# EAGLE design LAMPS (EAGLE 6.3)
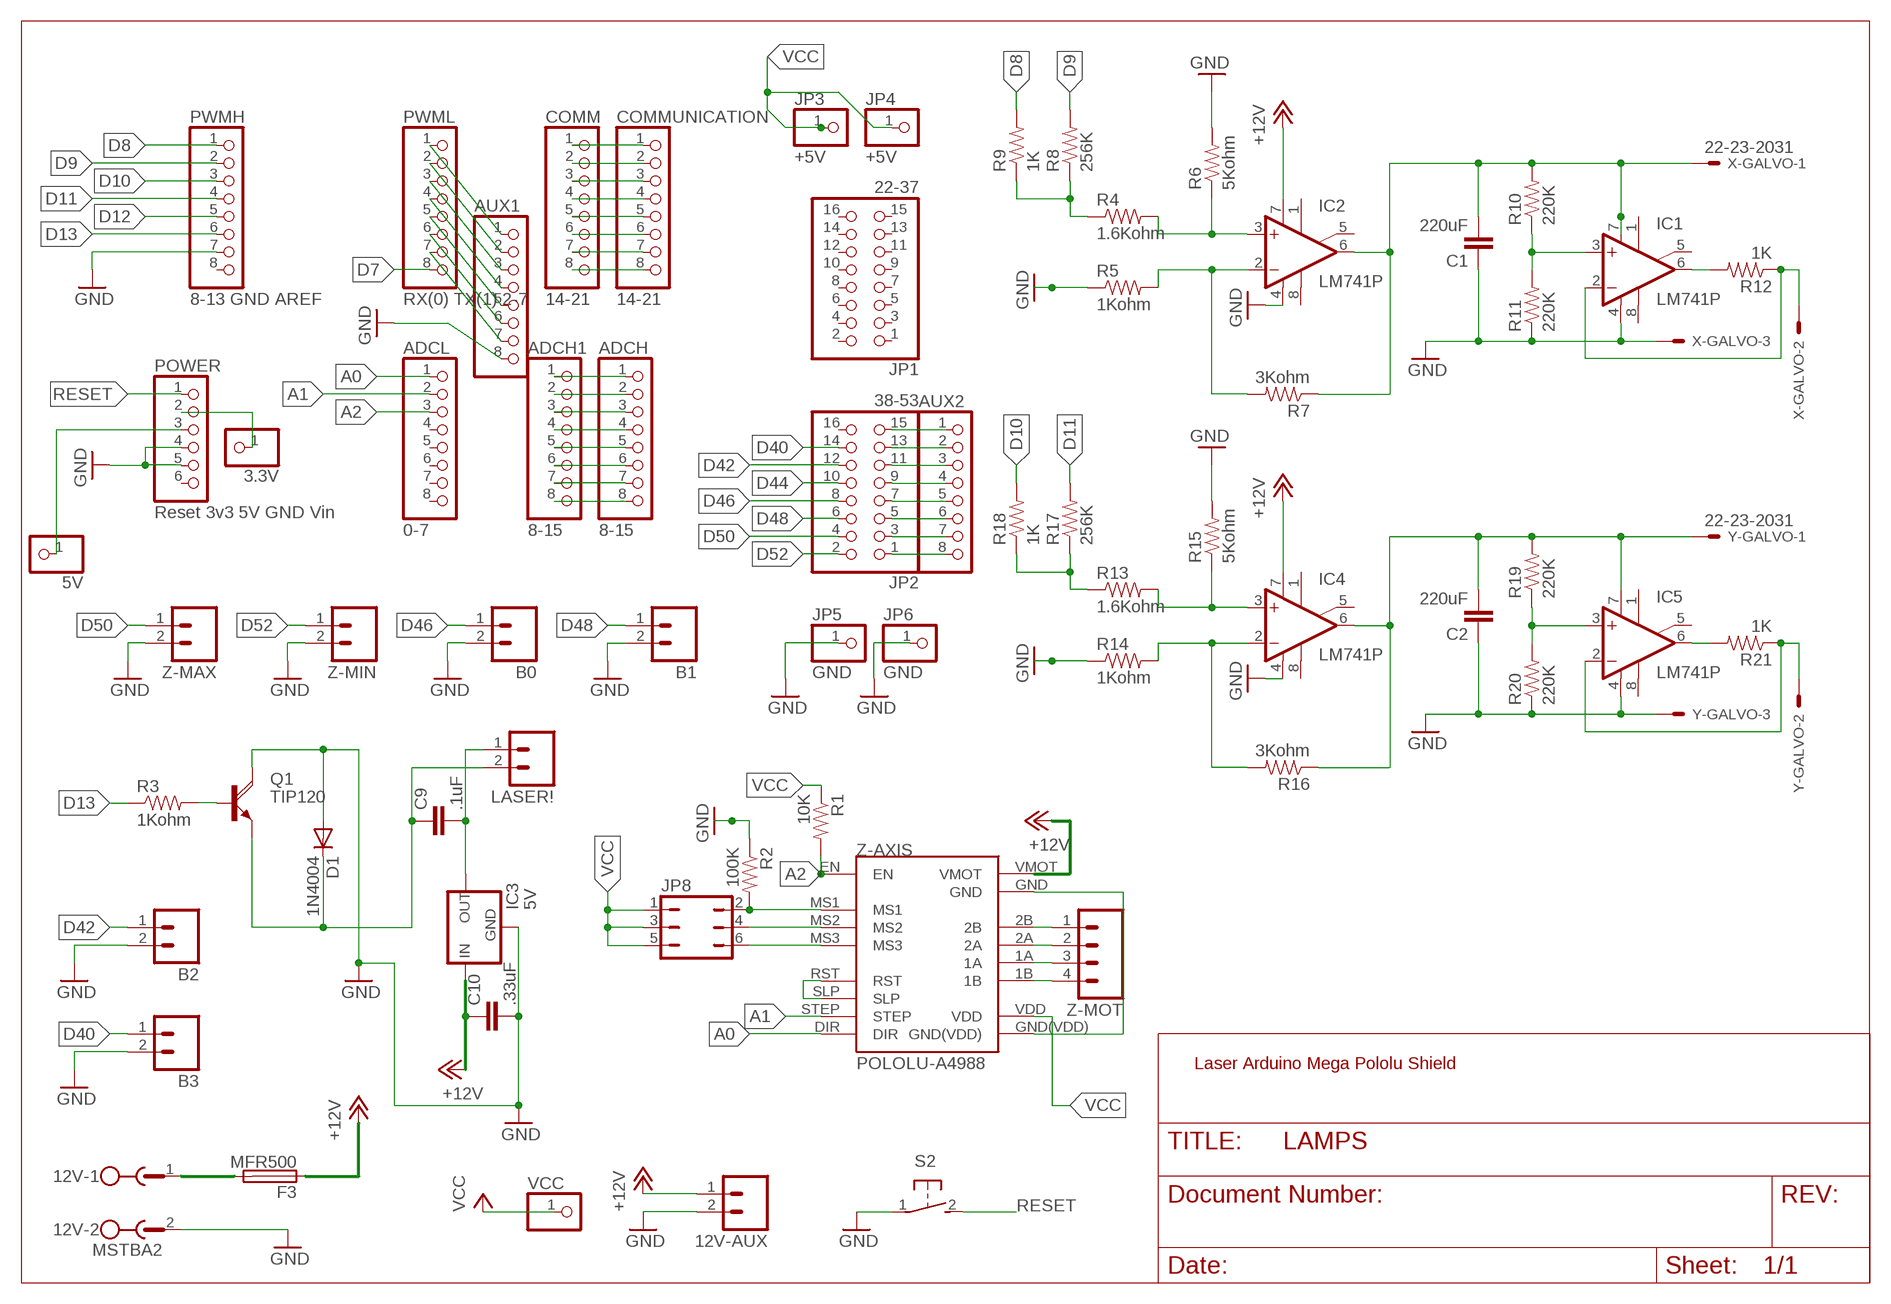
[diagram p0: schematic, sheet 1]

## Parts
3.3V  PINHD-1X1  [1X01]
5V  PINHD-1X1  [1X01]
12V  MSTBA2  [MSTBA2]
12V-AUX  M02PTH  [1X02]
ADCH  8-15  PINHD-1X8  [1X08]
ADCH1  8-15  PINHD-1X8  [1X08]
ADCL  0-7  PINHD-1X8  [1X08]
AUX1  14-21  PINHD-1X8  [1X08]
AUX2  14-21  PINHD-1X8  [1X08]
B0  M02PTH  [1X02]
B1  M02PTH  [1X02]
B2  M02PTH  [1X02]
B3  M02PTH  [1X02]
C1  220uF  CAPPTH  [CAP-PTH-SMALL]
C2  220uF  CAPPTH  [CAP-PTH-SMALL]
C9  .1uF  CAPPTH  [CAP-PTH-SMALL]
C10  .33uF  CAPPTH  [CAP-PTH-SMALL]
COMM  14-21  PINHD-1X8  [1X08]
COMMUNICATION  14-21  PINHD-1X8  [1X08]
D1  1N4004  [DO41-10]
F3  MFR500  PTCFUSE  [MFR500]
IC1  LM741P  [DIL08]
IC2  LM741P  [DIL08]
IC3  5V  V_REG_78XXSIDE  [78XXL]
IC4  LM741P  [DIL08]
IC5  LM741P  [DIL08]
JP1  22-37  PINHD-2X8  [2X08]
JP2  38-53  PINHD-2X8  [2X08]
JP3  +5V  PINHD-1X1  [1X01]
JP4  +5V  PINHD-1X1  [1X01]
JP5  GND  PINHD-1X1  [1X01]
JP6  GND  PINHD-1X1  [1X01]
JP8  JP3Q  [JP3Q]
LASER!  M02POLAR  [MOLEX-1X2]
POWER  Reset 3v3 5V GND Vin  PINHD-1X6  [1X06]
PWMH  8-13 GND AREF  PINHD-1X8  [1X08]
PWML  RX(0) TX(1) 2-7  PINHD-1X8  [1X08]
Q1  TIP120  [TO220AH]
R1  10K  RESISTORAXIAL-0.3  [AXIAL-0.3]
R2  100K  RESISTORAXIAL-0.3  [AXIAL-0.3]
R3  1Kohm  RESISTORAXIAL-0.3  [AXIAL-0.3]
R4  1.6Kohm  RESISTORAXIAL-0.3  [AXIAL-0.3]
R5  1Kohm  RESISTORAXIAL-0.3  [AXIAL-0.3]
R6  5Kohm  RESISTORAXIAL-0.3  [AXIAL-0.3]
R7  3Kohm  RESISTORAXIAL-0.3  [AXIAL-0.3]
R8  256K  RESISTORAXIAL-0.3  [AXIAL-0.3]
R9  1K  RESISTORAXIAL-0.3  [AXIAL-0.3]
R10  220K  RESISTORAXIAL-0.3  [AXIAL-0.3]
R11  220K  RESISTORAXIAL-0.3  [AXIAL-0.3]
R12  1K  RESISTORAXIAL-0.3  [AXIAL-0.3]
R13  1.6Kohm  RESISTORAXIAL-0.3  [AXIAL-0.3]
R14  1Kohm  RESISTORAXIAL-0.3  [AXIAL-0.3]
R15  5Kohm  RESISTORAXIAL-0.3  [AXIAL-0.3]
R16  3Kohm  RESISTORAXIAL-0.3  [AXIAL-0.3]
R17  256K  RESISTORAXIAL-0.3  [AXIAL-0.3]
R18  1K  RESISTORAXIAL-0.3  [AXIAL-0.3]
R19  220K  RESISTORAXIAL-0.3  [AXIAL-0.3]
R20  220K  RESISTORAXIAL-0.3  [AXIAL-0.3]
R21  1K  RESISTORAXIAL-0.3  [AXIAL-0.3]
S2  31-XX  [B3F-31XX]
VCC  PINHD-1X1  [1X01]
X-GALVO  22-23-2031  [22-23-2031]
Y-GALVO  22-23-2031  [22-23-2031]
Z-AXIS  POLOLU-A4988  [DIL_A4988]
Z-MAX  M02PTH  [1X02]
Z-MIN  M02PTH  [1X02]
Z-MOT  M04POLAR  [MOLEX-1X4]

## Nets
+12V: 12V-AUX.1 C10.1 F3.1 IC2.7(V+) IC3.IN IC4.7(V+) Z-AXIS.VMOT
A0: ADCL.1 Z-AXIS.DIR
A1: ADCL.2 Z-AXIS.STEP
A2: ADCL.3 R1.P$2 Z-AXIS.EN
D7: PWML.8
D8: PWMH.1 R9.P$2
D9: PWMH.2 R8.P$2
D10: PWMH.3 R18.P$2
D11: PWMH.4 R17.P$2
D12: PWMH.5
D13: PWMH.6 R3.P$1
D40: B3.1 JP2.14
D42: B2.1 JP2.12
D44: JP2.10 Q1.B R3.P$2
D46: B0.1 JP2.8
D48: B1.1 JP2.6
D50: JP2.4 Z-MAX.1
D52: JP2.2 Z-MIN.1
GND: 12V-AUX.2 12V.2 AUX1.8 B0.2 B1.2 B2.2 B3.2 C1.1 C2.1 C10.2 D1.A IC1.4(V-) IC2.4(V-) IC3.GND IC4.4(V-) IC5.4(V-) JP5.1 JP6.1 POWER.4 POWER.5 PWMH.7 Q1.C R2.P$1 R5.P$1 R6.P$2 R11.P$1 R14.P$1 R15.P$2 R20.P$1 S2.1(P) X-GALVO.3 Y-GALVO.3 Z-MAX.2 Z-MIN.2
N$1: IC2.3(+IN) R4.P$2 R6.P$1
N$2: IC2.2(-IN) R5.P$2 R7.P$2
N$3: IC1.3(+IN) R10.P$1 R11.P$2
N$4: R4.P$1 R8.P$1 R9.P$1
N$5: IC4.3(+IN) R13.P$2 R15.P$1
N$6: C1.2 IC1.7(V+) IC2.6(OUT) R7.P$1 R10.P$2 X-GALVO.1
N$7: IC1.6(OUT) R12.P$2
N$8: 3.3V.1 POWER.2
N$9: COMM.1 COMMUNICATION.1
N$10: 5V.1 POWER.3
N$11: Z-AXIS.RST Z-AXIS.SLP
N$12: C9.2 IC3.OUT LASER!.1
N$13: C9.1 D1.C LASER!.2 Q1.E
N$14: Z-AXIS.GND Z-AXIS.GND(VDD)
N$15: JP8.2 R2.P$2 Z-AXIS.MS1
N$16: JP8.4 Z-AXIS.MS2
N$17: JP8.6 Z-AXIS.MS3
N$18: IC1.2(-IN) R12.P$1 X-GALVO.2
N$19: IC4.2(-IN) R14.P$2 R16.P$2
N$20: Z-AXIS.2B Z-MOT.1
N$21: Z-AXIS.2A Z-MOT.2
N$22: Z-AXIS.1A Z-MOT.3
N$23: Z-AXIS.1B Z-MOT.4
N$24: R13.P$1 R17.P$1 R18.P$1
N$25: C2.2 IC4.6(OUT) IC5.7(V+) R16.P$1 R19.P$2 Y-GALVO.1
N$26: IC5.3(+IN) R19.P$1 R20.P$2
N$27: IC5.6(OUT) R21.P$2
N$28: IC5.2(-IN) R21.P$1 Y-GALVO.2
N$29: COMM.2 COMMUNICATION.2
N$35: COMM.3 COMMUNICATION.3
N$36 [power]: 12V.1 F3.2
N$37: COMM.4 COMMUNICATION.4
N$38: COMM.5 COMMUNICATION.5
N$39: COMM.6 COMMUNICATION.6
N$40: COMM.7 COMMUNICATION.7
N$41: COMM.8 COMMUNICATION.8
N$42: ADCH1.1 ADCH.1
N$43: ADCH1.2 ADCH.2
N$44: ADCH1.3 ADCH.3
N$45: ADCH1.4 ADCH.4
N$46: ADCH1.5 ADCH.5
N$47: ADCH1.6 ADCH.6
N$48: ADCH1.7 ADCH.7
N$49: ADCH1.8 ADCH.8
N$66: AUX2.1 JP2.15
N$67: AUX2.2 JP2.13
N$68: AUX2.3 JP2.11
N$69: AUX2.4 JP2.9
N$70: AUX2.5 JP2.7
N$71: AUX2.6 JP2.5
N$72: AUX2.7 JP2.3
N$73: AUX2.8 JP2.1
N$74: AUX1.1 PWML.1
N$75: AUX1.2 PWML.2
N$76: AUX1.3 PWML.3
N$77: AUX1.4 PWML.4
N$78: AUX1.5 PWML.5
N$79: AUX1.6 PWML.6
N$80: AUX1.7 PWML.7
RESET: POWER.1 S2.2(S)
VCC: JP3.1 JP4.1 JP8.1 JP8.3 JP8.5 R1.P$1 VCC.1 Z-AXIS.VDD
Unconnected: ADCL.4 ADCL.5 ADCL.6 ADCL.7 ADCL.8 IC1.1(ON1) IC1.5(ON2) IC1.8(OPT) IC2.1(ON1) IC2.5(ON2) IC2.8(OPT) IC4.1(ON1) IC4.5(ON2) IC4.8(OPT) IC5.1(ON1) IC5.5(ON2) IC5.8(OPT) JP1.1 JP1.2 JP1.3 JP1.4 JP1.5 JP1.6 JP1.7 JP1.8 JP1.9 JP1.10 JP1.11 JP1.12 JP1.13 JP1.14 JP1.15 JP1.16 JP2.16 POWER.6 PWMH.8

## Notes on the sheet
- Laser Arduino Mega Pololu Shield

## Library data of the parts
3.3V 5V VCC = adafruit:PINHD-1X1: Pin header 1x1 for 0.1" spacing With round pins; OC_NEWARK: unknown
12V = con-phoenix-508:MSTBA2: PHOENIX; MF: FARNELL; MPN: 1757242; OC_FARNELL: 3705171; OC_NEWARK: 71C4161
12V-AUX B0 B1-B3 LASER! Z-MAX Z-MIN = SparkFun:M02: Header 2 Standard 2-pin 0.1" header. Use with straight break away headers (SKU : PRT-00116), right angle break away headers (PRT-00553), swiss pins (PRT-00743), machine pins (PRT-00117), and female headers (PRT-00115). Molex polarized connector foot print use with SKU : PRT-08233 with associated crimp pins and housings.; OC_NEWARK: unknown
ADCH ADCH1 ADCL AUX1 AUX2 COMM COMMUNICATION PWMH PWML = pinhead:PINHD-1X8: PIN HEADER; OC_NEWARK: unknown
C1 C2 = SparkFun:CAP: Capacitor Standard 0603 ceramic capacitor, and 0.1" leaded capacitor.; MPN: 100PK220MEFC12.5X20; OC_NEWARK: 39T8339
C9 C10 = SparkFun:CAP: Capacitor Standard 0603 ceramic capacitor, and 0.1" leaded capacitor.; OC_NEWARK: unknown
D1 = diode:1N4004: DIODE general purpose rectifier, 1 A; OC_NEWARK: unknown
F3 = RepRapjr:PTCFUSE: LITTLEFUSE Picofuse/slow Littlefuse; OC_NEWARK: unknown
IC1 IC2 IC4 IC5 = linear:*741: OP AMP; OC_NEWARK: unknown
IC3 = SparkFun:V_REG_78XX: Voltage Regulator Standard 7805 5V regulator. IGO (Input Ground Output). Spark Fun Electronics SKU : COM-00107; OC_NEWARK: unknown
JP1 JP2 = pinhead:PINHD-2X8: PIN HEADER; OC_NEWARK: unknown
JP3-JP6 = pinhead:PINHD-1X1: PIN HEADER; OC_NEWARK: unknown
JP8 = jumper:JP3Q: JUMPER; OC_NEWARK: unknown
POWER = pinhead:PINHD-1X6: PIN HEADER; OC_NEWARK: unknown
Q1 = transistor-power:TIP120: NPN DARLINGTON TRANSISTOR; OC_NEWARK: unknown
R1-R21 = SparkFun:RESISTOR: Resistor Basic schematic elements and footprints for 0603, 1206, and PTH resistors.; OC_NEWARK: unknown
S2 = switch-omron:31-XX: OMRON SWITCH; MPN: B3F-3100; OC_FARNELL: 959704; OC_NEWARK: unknown
X-GALVO Y-GALVO = con-molex:22-23-2031: .100" (2.54mm) Center Header - 3 Pin; MF: MOLEX; MPN: 22-23-2031; OC_FARNELL: 1462950; OC_NEWARK: 30C0862
Z-AXIS = Pololu-A4988:POLOLU-A4988; OC_NEWARK: unknown
Z-MOT = SparkFun:M04: Header 4 Standard 4-pin 0.1" header. Use with straight break away headers (SKU : PRT-00116), right angle break away headers (PRT-00553), swiss pins (PRT-00743), machine pins (PRT-00117), and female headers (PRT-00115). Molex polarized connector foot print use with SKU : PRT-08231 with associated crimp pins and housings. 1MM SMD Version SKU: PRT-10208; OC_NEWARK: unknown

## Net classes
0 default: width 0.203 mm, drill 0.406 mm, clearance 0.203 mm
1 power: width 0.61 mm, drill 0.711 mm, clearance 0.203 mm
2 gnd: width 0.305 mm, drill 0.711 mm, clearance 0.203 mm
3 usbvcc: width 0.508 mm, drill 0.711 mm, clearance 0.203 mm

## Board
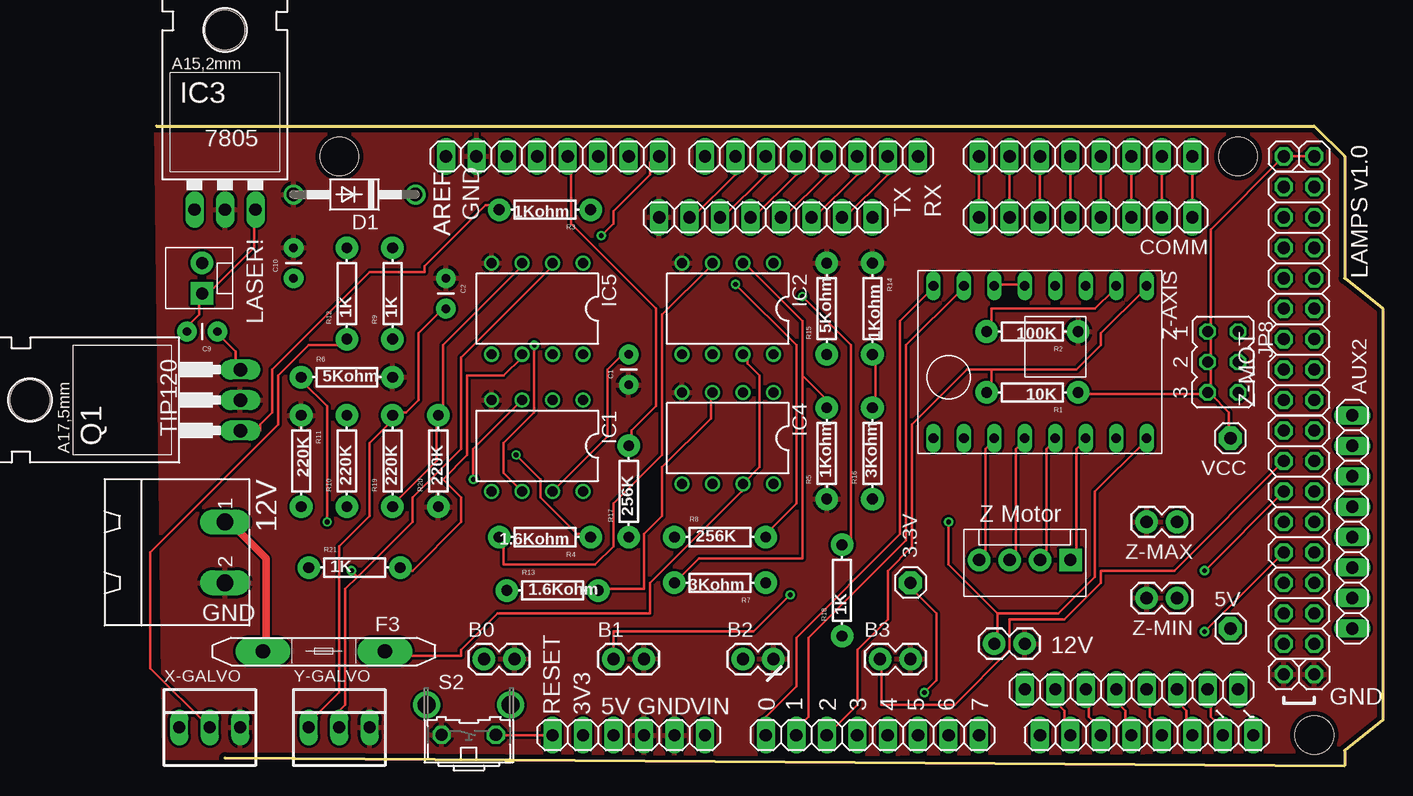
[diagram p1: board, top side]
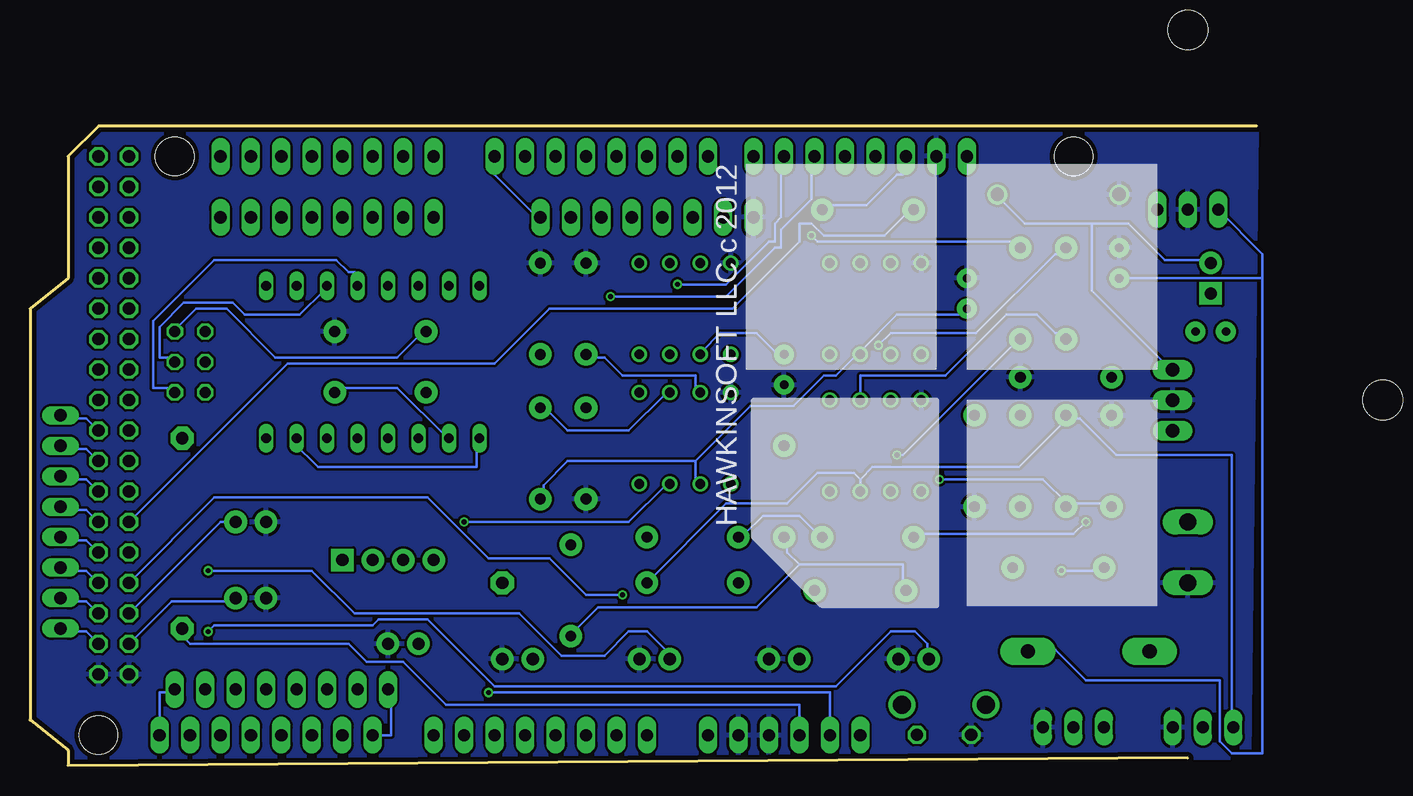
[diagram p2: board, bottom side, seen from below]

Size 102.23 x 53.34 mm. Coordinates in mm from the lower left corner, seen from the top.
Outline: 0,53.34 96.52,53.34 99.06,50.8 99.06,40.64 102.23,38.1 102.23,3.81 99.06,1.27 99.06,0 5.71,0.64
Copper layers (1*16): Top 0.0356mm / dielectric 1.5011mm / Bottom 0.0356mm
Design rules "LaenPCBOrder": minimum track width 6mil, minimum drill 13mil, track to track 6mil, track to pad 6mil, pad to pad 6mil, via to via 6mil, smd to smd 6mil, copper to edge 15mil, drill to drill 6mil, minimum pad ring 7mil, minimum via ring 7mil, stop-mask expansion 4mil, vias tented up to drill 0mil, thermal gap 10mil
Holes 3.2 mm at 96.52,2.54 15.24,50.8 90.17,50.8

### Footprints (pad centres in the part's own frame; a part is rotated, then mirrored left to right if it is on the bottom)
1X01 = drill 1.016 pad 1.93 octagon: 1 0,0
MSTBA2 = drill 1.397 long: 1 -2.54,5.08; 2 2.54,5.08
1X02 = drill 1.016 pad 1.88: 1 0,0; 2 2.54,0
1X08 = drill 1.016 long: 1 -8.89,0; 2 -6.35,0; 3 -3.81,0; 4 -1.27,0; 5 1.27,0; 6 3.81,0; 7 6.35,0; 8 8.89,0
CAP-PTH-SMALL = drill 0.7 pad 1.651: 1 0,0; 2 2.54,0
DO41-10 = drill 1.118: A 5.08,0; C -5.08,0
MFR500 = drill 1.2 pad 2.3 long: 1 -5.08,0; 2 5.08,0
DIL08 = drill 0.813 pad 1.27: 1 -3.81,-3.81; 2 -1.27,-3.81; 3 1.27,-3.81; 4 3.81,-3.81; 5 3.81,3.81; 6 1.27,3.81; 7 -1.27,3.81; 8 -3.81,3.81
78XXL = drill 1.016 long: GND 0,-3.81; IN -2.54,-3.81; OUT 2.54,-3.81 | hole 3.302: 0,11.176
2X08 = drill 1.016 octagon: 1 -8.89,-1.27; 2 -8.89,1.27; 3 -6.35,-1.27; 4 -6.35,1.27; 5 -3.81,-1.27; 6 -3.81,1.27; 7 -1.27,-1.27; 8 -1.27,1.27; 9 1.27,-1.27; 10 1.27,1.27; 11 3.81,-1.27; 12 3.81,1.27; 13 6.35,-1.27; 14 6.35,1.27; 15 8.89,-1.27; 16 8.89,1.27
1X01' = drill 1.016 octagon: 1 0,0
JP3Q = drill 0.914 octagon: 1 -2.54,-1.27; 2 -2.54,1.27; 3 0,-1.27; 4 0,1.27; 5 2.54,-1.27; 6 2.54,1.27
MOLEX-1X2 = drill 1.016 pad 1.88 square: 1 0,0 | drill 1.016 pad 1.88: 2 2.54,0
1X06 = drill 1.016 long: 1 -6.35,0; 2 -3.81,0; 3 -1.27,0; 4 1.27,0; 5 3.81,0; 6 6.35,0
TO220AH = drill 1.118 long: B -2.54,-6.35; C 0,-6.35; E 2.54,-6.35 | hole 3.302: 0,11.176
AXIAL-0.3 = drill 0.9 pad 1.88: P$1 -3.81,0; P$2 3.81,0
B3F-31XX = drill 1.016 octagon: 1 -2.261,-1.245; 2 2.261,-1.245 | drill 1.499 pad 2.159: 3 -3.505,1.245; 4 3.505,1.245
22-23-2031 = drill 1 long: 1 -2.54,0; 2 0,0; 3 2.54,0
DIL_A4988 = drill 0.8 long: 1A 12.7,7.62; 1B 12.7,5.08; 2A 12.7,10.16; 2B 12.7,12.7; DIR 0,0; EN 0,17.78; GND 12.7,15.24; GND(VDD) 12.7,0; MS1 0,15.24; MS2 0,12.7; MS3 0,10.16; RST 0,7.62; SLP 0,5.08; STEP 0,2.54; VDD 12.7,2.54; VMOT 12.7,17.78
MOLEX-1X4 = drill 1.016 pad 1.88 square: 1 0,0 | drill 1.016 pad 1.88: 2 2.54,0; 3 5.08,0; 4 7.62,0

### Placement (x,y rotation side)
3.3V  62.87,15.24 270 top
5V  89.53,11.43 0 top
12V  0.64,17.78 270 top
12V-AUX  69.85,10.16 0 top
ADCH  82.55,2.54 0 top
ADCH1  81.28,6.35 0 top
ADCL  59.69,2.54 0 top
AUX1  50.8,45.72 180 top
AUX2  99.69,20.32 270 top
B0  27.3,8.89 0 top
B1  38.1,8.89 0 top
B2  48.9,8.89 0 top
B3  60.33,8.89 0 top
C1  39.37,31.75 90 top
C2  24.13,40.64 270 top
C9  5.08,36.2 180 top
C10  11.43,40.64 90 top
COMM  77.47,45.72 180 top
COMMUNICATION  77.47,50.8 180 top
D1  16.51,47.62 180 top
F3  13.97,9.53 180 top
IC1  31.75,26.67 180 top
IC2  47.62,38.1 180 top
IC3  5.71,50.16 0 top
IC4  47.62,27.3 180 top
IC5  31.75,38.1 180 top
JP1  95.25,39.37 90 top
JP2  95.25,19.05 90 top
JP3  +5V  [1X01']  93.98,50.8 0 top
JP4  +5V  [1X01']  96.52,50.8 0 top
JP5  GND  [1X01']  93.98,7.62 0 top
JP6  GND  [1X01']  96.52,7.62 0 top
JP8  88.9,33.66 270 top
LASER!  3.81,39.37 90 top
POWER  39.37,2.54 0 top
PWMH  33.02,50.8 180 top
PWML  54.61,50.8 180 top
Q1  0.64,30.48 90 top
R1  73.03,31.11 180 top
R2  73.03,36.2 180 top
R3  32.38,46.35 180 top
R4  32.38,19.05 180 top
R5  55.88,26.04 90 top
R6  15.88,32.38 0 top
R7  46.99,15.24 180 top
R8  46.99,19.05 0 top
R9  19.68,39.37 90 top
R10  15.88,25.4 90 top
R11  12.06,25.4 270 top
R12  15.88,39.37 90 top
R13  33.02,14.61 0 top
R14  59.69,38.1 270 top
R15  55.88,38.1 90 top
R16  59.69,26.04 90 top
R17  39.37,22.86 90 top
R18  57.15,14.61 90 top
R19  19.68,25.4 90 top
R20  23.5,25.4 90 top
R21  16.51,16.51 0 top
S2  26.04,3.81 0 top
VCC  89.53,27.3 180 top
X-GALVO  4.45,3.17 0 top
Y-GALVO  15.24,3.17 0 top
Z-AXIS  64.77,40.01 270 top
Z-MAX  85.09,20.32 180 top
Z-MIN  85.09,13.97 180 top
Z-MOT  76.2,17.14 180 top

### Tracks (layer width: path | path; a pad name or v marks a point on that pad's centre or on a via)
+12V  (via drill 0.41)
  Top 0.203: 70.1,12.7 75.18,12.7 78.23,15.75 78.23,22.86 82.3,26.92 Z-AXIS.VMOT | 70.1,12.7 70.1,10.16 12V-AUX.1 | IC2.7 49.28,34.04 49.28,33.53 50.29,32.51 50.29,24.89 IC4.7 48.77,23.37 48.77,22.86 41.15,15.24 41.15,12.7 28.45,12.7 25.4,9.65 25.4,9.14 19.3,9.14 F3.1 | 70.1,12.7 66.04,16.76 v66.04,20.32
  Bottom 0.203: IC3.IN -0.51,42.67 -0.51,40.64 | C10.1 -0.51,40.64 | -0.51,40.64 -0.51,1.02 2.03,1.02 3.05,2.03 3.05,7.11 14.22,7.11 16.76,9.65 18.8,9.65 F3.1 | v66.04,20.32 52.32,20.32 49.28,23.37 IC4.7
A0
  Top 0.203: ADCL.1 50.8,4.06 53.34,6.6 53.34,10.67 61.98,19.3 61.98,37.08 64.52,39.62 Z-AXIS.DIR
A1
  Top 0.203: ADCL.2 53.34,3.05 54.36,4.06 54.36,10.67 62.48,18.8 62.48,35.05 67.06,39.62 Z-AXIS.STEP
A2
  Top 0.203: 69.6,33.02 76.71,33.02 78.74,35.05 78.74,36.07 82.3,39.62 Z-AXIS.EN | 69.6,33.02 69.6,31.5 R1.P$2 | ADCL.3 58.42,5.08 58.42,9.65 60.96,12.19 60.96,16.26 62.99,18.29 62.99,28.45 67.56,33.02 69.6,33.02
D8  (via drill 0.41)
  Top 0.203: v37.08,44.2 38.1,45.21 38.1,46.23 41.15,49.28 41.15,50.29 41.66,50.8 PWMH.1
  Bottom 0.203: v37.08,44.2 36.58,43.69 20.32,43.69 19.81,43.18 R9.P$2
D9  (via drill 0.41)
  Top 0.203: v48.26,40.13 53.34,35.05 53.34,21.84 50.8,19.3 R8.P$2
  Bottom 0.203: v48.26,40.13 44.2,40.13 40.64,43.69 40.13,43.69 40.13,45.21 39.62,45.72 39.62,50.8 PWMH.2
D10  (via drill 0.41)
  Top 0.203: v53.85,39.12 57.91,35.05 57.91,18.8 57.4,18.29 R18.P$2
  Bottom 0.203: v53.85,39.12 44.2,39.12 40.13,43.18 39.62,43.18 39.62,44.7 37.08,47.24 37.08,50.8 PWMH.3
D11
  Top 0.203: PWMH.4 34.54,50.8 34.54,45.21 41.66,38.1 41.66,29.97 39.62,27.94 39.62,26.92 R17.P$2
D13
  Bottom 0.203: PWMH.6 29.46,50.8 29.46,49.28 29.97,49.28 32.51,46.74 36.07,46.74 R3.P$1
D40
  Top 0.203: JP2.14 84.84,16.26 78.74,16.26 78.74,15.24 75.69,12.19 71.12,12.19 71.12,9.65 66.55,5.08 60.45,5.08 60.45,8.64 B3.1
D42  (via drill 0.41)
  Top 0.203: v87.38,16.26 JP2.12
  Bottom 0.203: v87.38,16.26 78.74,16.26 75.18,12.7 61.47,12.7 57.91,9.14 54.36,9.14 52.32,11.18 50.8,11.18 48.77,9.14 B2.1
D44
  Top 0.203: Q1.B 8.64,27.94 8.64,28.45 9.65,29.46 9.65,33.02 17.78,41.15 22.35,41.15 22.35,41.66 27.43,46.74 28.45,46.74 R3.P$2
  Bottom 0.203: JP2.10 80.77,33.53 63.5,33.53 58.93,38.1 43.69,38.1 38.1,43.69 38.1,45.21 37.08,45.21 36.07,44.2 30.99,44.2 28.96,46.23 R3.P$2
D46  (via drill 0.41)
  Top 0.203: v87.38,11.18 JP2.8
  Bottom 0.203: v87.38,11.18 86.87,11.68 73.66,11.68 73.15,12.19 69.09,12.19 63.5,6.6 35.05,6.6 30.48,11.18 28.45,11.18 27.43,10.16 27.43,9.14 B0.1
D48  (via drill 0.41)
  Top 0.203: v52.83,14.22 49.78,11.18 38.1,11.18 B1.1
  Bottom 0.203: JP2.6 86.87,22.35 69.09,22.35 64.01,17.27 58.93,17.27 55.88,14.22 v52.83,14.22
D50
  Bottom 0.203: JP2.4 86.36,20.32 Z-MAX.1
D52
  Bottom 0.203: JP2.2 90.42,13.72 85.34,13.72 Z-MIN.1
GND
  pour Bottom: 0,53.34 0.64,0.64 102.87,0 102.87,53.34
  pour Top: 0,53.34 0.64,0.64 102.87,1.27 102.87,53.34
N$1  (via drill 0.41)
  Top 0.203: IC2.3 46.23,41.66 42.16,37.59 42.16,25.91 38.1,21.84 38.1,18.29 36.58,16.76 28.96,16.76 28.96,18.8 R4.P$2 | v14.22,20.32 14.22,29.97 12.19,32 R6.P$1
  Bottom 0.203: v14.22,20.32 15.24,19.3 28.45,19.3 R4.P$2
N$2
  Top 0.203: 53.85,32.51 53.85,37.08 49.28,41.66 IC2.2 | 53.85,32.51 55.88,30.48 R5.P$2 | R7.P$2 45.21,17.27 53.85,17.27 53.85,32.51
N$3  (via drill 0.41)
  Top 0.203: IC1.3 26.42,26.42 v26.42,23.88
  Bottom 0.203: v26.42,23.88 17.78,23.88 15.75,21.84 | 15.75,21.84 12.19,21.84 R11.P$2 | 15.75,21.84 R10.P$1
N$4  (via drill 0.41)
  Top 0.203: v29.97,25.91 32,23.88 32,22.35 35.05,19.3 36.07,19.3 R4.P$1
  Bottom 0.203: R4.P$1 36.58,19.3 38.1,20.83 41.15,20.83 42.67,19.3 43.18,19.3 R8.P$1 | v29.97,25.91 29.46,25.91 19.81,35.56 R9.P$1
N$5
  Top 0.203: R13.P$2 37.08,14.73 40.64,14.73 40.64,19.3 42.16,20.83 42.16,24.89 46.23,28.96 46.23,30.99 IC4.3
  Bottom 0.203: IC4.3 46.74,31.5 46.74,32.51 52.83,32.51 54.36,34.04 55.88,34.04 R15.P$1
N$6
  Top 0.203: IC1.7 37.59,27.43 37.59,33.02 39.12,34.54 C1.2
  Bottom 0.203: IC2.6 46.23,34.54 44.7,36.07 41.66,36.07 40.13,34.54 39.62,34.54 C1.2 | R7.P$1 44.2,21.84 39.12,21.84 36.58,24.38 33.53,24.38 33.02,23.88 | IC1.7 33.02,23.88 | 15.75,28.96 14.73,28.96 11.68,25.91 2.03,25.91 2.03,3.56 X-GALVO.1 | 33.02,23.88 32,24.89 19.81,24.89 15.75,28.96 | 15.75,28.96 R10.P$2
N$7  (via drill 0.41)
  Top 0.203: IC1.6 28.96,24.38 28.96,26.92 31.5,29.46 v31.5,35.05
  Bottom 0.203: v31.5,35.05 30.48,36.07 23.37,36.07 16.76,42.67 16.26,42.67 15.75,43.18 R12.P$2
N$8  (via drill 0.41)
  Top 0.203: v64.01,6.1 65.02,7.11 65.02,12.7 62.99,14.73 62.99,15.24 3.3V.1
  Bottom 0.203: POWER.2 35.56,6.1 v64.01,6.1
N$9
  Top 0.203: COMMUNICATION.1 COMM.1
N$10
  Bottom 0.203: POWER.3 38.1,5.08 67.56,5.08 71.12,8.64 74.17,8.64 75.69,10.16 88.9,10.16 89.92,11.18 5V.1
N$11
  Top 0.203: Z-AXIS.SLP 70.1,40.13 72.14,40.13 Z-AXIS.RST
N$12
  Top 0.203: IC3.OUT 8.13,46.23 8.13,43.18 4.06,39.12 LASER!.1 3.56,39.12 3.56,37.59 2.54,36.58 C9.2
N$13
  Top 0.203: C9.1 5.08,36.07 6.6,34.54 6.6,33.02 Q1.E
  Bottom 0.203: 13.72,45.21 10.67,45.21 7.62,42.16 4.06,42.16 LASER!.2 | 13.72,45.21 19.3,45.21 21.34,47.24 D1.C | 13.72,45.21 13.72,39.62 7.11,33.02 Q1.E
N$14
  Bottom 0.203: Z-AXIS.GND(VDD) 65.02,26.92 65.02,24.89 78.23,24.89 80.26,26.92 Z-AXIS.GND
N$15
  Top 0.203: Z-AXIS.MS1 79.76,39.62 78.23,38.1 69.6,38.1 69.6,36.58 R2.P$2
  Bottom 0.203: JP8.2 89.92,36.58 88.39,38.1 85.85,38.1 81.79,34.04 71.63,34.04 69.6,36.07 R2.P$2
N$16
  Bottom 0.203: Z-AXIS.MS2 77.72,39.62 79.76,37.59 84.33,37.59 85.34,38.61 89.41,38.61 91.44,36.58 91.44,34.04 90.42,34.04 JP8.4
N$17
  Bottom 0.203: Z-AXIS.MS3 75.18,40.13 75.18,41.15 75.69,41.15 76.71,42.16 86.87,42.16 91.95,37.08 91.95,31.5 90.42,31.5 JP8.6
N$18
  Top 0.203: X-GALVO.2 -0.51,8.13 -0.51,17.78 10.16,28.45 10.16,32.51 12.7,35.05 15.75,35.05 15.75,35.56 R12.P$1
  Bottom 0.203: IC1.2 33.02,32.51 25.91,32.51 20.83,37.59 18.29,37.59 16.76,36.07 16.26,36.07 15.75,35.56 R12.P$1
N$19
  Top 0.203: R14.P$2 59.94,34.04 59.94,29.97 R16.P$2
  Bottom 0.203: IC4.2 49.28,30.99 52.32,27.94 57.4,27.94 58.93,29.46 59.44,29.46 R16.P$2
N$20
  Top 0.203: Z-AXIS.2B 77.22,26.92 76.71,26.42 76.71,17.78 76.2,17.27 Z-MOT.1
N$21
  Top 0.203: Z-AXIS.2A 74.68,26.92 74.17,26.42 74.17,17.78 73.66,17.27 Z-MOT.2
N$22
  Top 0.203: Z-AXIS.1A 72.14,26.92 71.63,26.42 71.63,17.78 71.12,17.27 Z-MOT.3
N$23
  Top 0.203: Z-AXIS.1B 69.6,26.92 69.09,26.42 69.09,17.78 68.58,17.27 Z-MOT.4
N$24
  Bottom 0.203: 38.1,16.76 29.46,16.76 29.46,14.73 R13.P$1 | 38.1,16.76 39.12,17.78 39.12,18.8 R17.P$1 | 38.1,16.76 41.66,13.21 54.86,13.21 56.9,11.18 R18.P$1
N$25
  Top 0.203: Y-GALVO.1 12.7,3.56 15.24,6.1 15.24,18.29 17.78,20.83 17.78,26.92 19.3,28.45 19.3,28.96 R19.P$2 19.81,29.46 20.83,29.46 21.84,30.48 21.84,36.07 23.88,38.1 C2.2
  Bottom 0.203: 46.74,25.4 46.74,23.88 IC4.6 | 46.74,25.4 57.4,25.4 59.44,23.37 59.44,22.35 R16.P$1 | C2.2 23.88,38.1 24.38,37.59 29.97,37.59 33.02,34.54 IC5.7 33.02,34.04 33.53,34.04 35.05,32.51 36.07,32.51 38.61,29.97 42.16,29.97 46.74,25.4
N$26
  Top 0.203: IC5.3 30.48,41.66 23.88,35.05 23.88,29.46 R20.P$2 23.37,28.96 23.37,25.4 19.81,21.84 R19.P$1
N$27
  Top 0.203: IC5.6 30.48,34.04 28.96,32.51 25.91,32.51 25.91,25.91 23.88,23.88 25.4,22.35 25.4,20.32 21.34,16.26 20.32,16.26 R21.P$2
N$28  (via drill 0.41)
  Top 0.203: 16.76,15.75 15.75,14.73 15.75,5.08 15.24,4.57 Y-GALVO.2 | 16.76,15.75 21.34,20.32 21.34,22.35 25.4,26.42 25.4,34.04 33.02,41.66 IC5.2 | 16.76,15.75 v16.26,16.26
  Bottom 0.203: v16.26,16.26 12.7,16.26 R21.P$1
N$29
  Top 0.203: COMMUNICATION.2 COMM.2
N$35
  Top 0.203: COMMUNICATION.3 COMM.3
N$36
  Top 0.61: 12V.1 6.1,20.32 9.14,17.27 9.14,9.65 F3.2
N$37
  Top 0.203: COMMUNICATION.4 COMM.4
N$38
  Top 0.203: COMMUNICATION.5 COMM.5
N$39
  Top 0.203: COMMUNICATION.6 COMM.6
N$40
  Top 0.203: COMMUNICATION.7 COMM.7
N$41
  Top 0.203: COMMUNICATION.8 COMM.8
N$42
  Bottom 0.203: ADCH.1 72.14,2.54 72.14,6.1 ADCH1.1
N$43
  Top 0.203: ADCH.2 75.69,3.05 75.69,4.57 75.18,5.08 75.18,6.1 ADCH1.2
N$44
  Top 0.203: ADCH.3 78.74,3.05 77.72,4.06 77.72,6.1 ADCH1.3
N$45
  Top 0.203: ADCH.4 80.77,3.05 80.77,4.57 80.26,5.08 80.26,6.1 ADCH1.4
N$46
  Top 0.203: ADCH.5 83.82,3.05 82.8,4.06 82.8,6.1 ADCH1.5
N$47
  Top 0.203: ADCH.6 85.85,3.05 85.85,4.57 85.34,5.08 85.34,6.1 ADCH1.6
N$48
  Top 0.203: ADCH.7 88.9,3.05 87.88,4.06 87.88,6.1 ADCH1.7
N$49
  Bottom 0.203: ADCH.8 91.44,6.1 90.42,6.1 ADCH1.8
N$66
  Bottom 0.203: JP2.15 97.54,28.96 99.57,28.96 AUX2.1
N$67
  Bottom 0.203: JP2.13 97.54,26.42 99.57,26.42 AUX2.2
N$68
  Bottom 0.203: JP2.11 97.54,23.88 99.57,23.88 AUX2.3
N$69
  Bottom 0.203: JP2.9 97.54,21.34 99.57,21.34 AUX2.4
N$70
  Bottom 0.203: JP2.7 97.54,18.8 99.57,18.8 AUX2.5
N$71
  Bottom 0.203: JP2.5 97.54,16.26 99.57,16.26 AUX2.6
N$72
  Bottom 0.203: JP2.3 97.54,13.72 99.57,13.72 AUX2.7
N$73
  Bottom 0.203: JP2.1 97.54,11.18 99.57,11.18 AUX2.8
N$74
  Bottom 0.203: PWML.1 63.5,49.28 59.94,45.72 AUX1.1
N$75
  Top 0.203: PWML.2 60.96,49.28 57.4,45.72 AUX1.2
N$76
  Top 0.203: PWML.3 58.42,49.28 54.86,45.72 AUX1.3
N$77
  Top 0.203: PWML.4 55.88,49.28 52.32,45.72 AUX1.4
N$78
  Top 0.203: PWML.5 53.34,49.28 49.78,45.72 AUX1.5
N$79
  Top 0.203: PWML.6 50.8,49.28 47.24,45.72 AUX1.6
N$80
  Top 0.203: PWML.7 48.26,49.28 44.7,45.72 AUX1.7
RESET
  Top 0.203: POWER.1 28.45,2.54 S2.2
VCC
  Top 0.203: JP4.1 JP3.1 87.88,44.7 87.88,36.58 JP8.1 87.88,36.07 87.88,34.04 JP8.3 87.88,33.53 87.88,31.5 JP8.5 | JP8.5 87.88,30.99 89.41,29.46 89.41,27.43 VCC.1 | R1.P$1 77.22,30.99 87.38,30.99 JP8.5
  Bottom 0.203: Z-AXIS.VDD 67.56,27.43 71.63,31.5 76.71,31.5 R1.P$1

### Text on the board
tPlace: LASER! | 0 | 1 | 2 | 3 | 4 | 5 | 6 | 7
bPlace: HAWKINSOFT LLC c 2012
tNames: 7805 | TX | RX | GND | AREF | AREF | LAMPS v1.0 | Z-MOT | TIP120 | Z Motor | GND | 12V | GND | RESET | 3V3 | 5V | GND | VIN